# EAGLE design Hatch2020Trophy0805_1 (EAGLE 9.5.0)

## Sheet 1 of 2
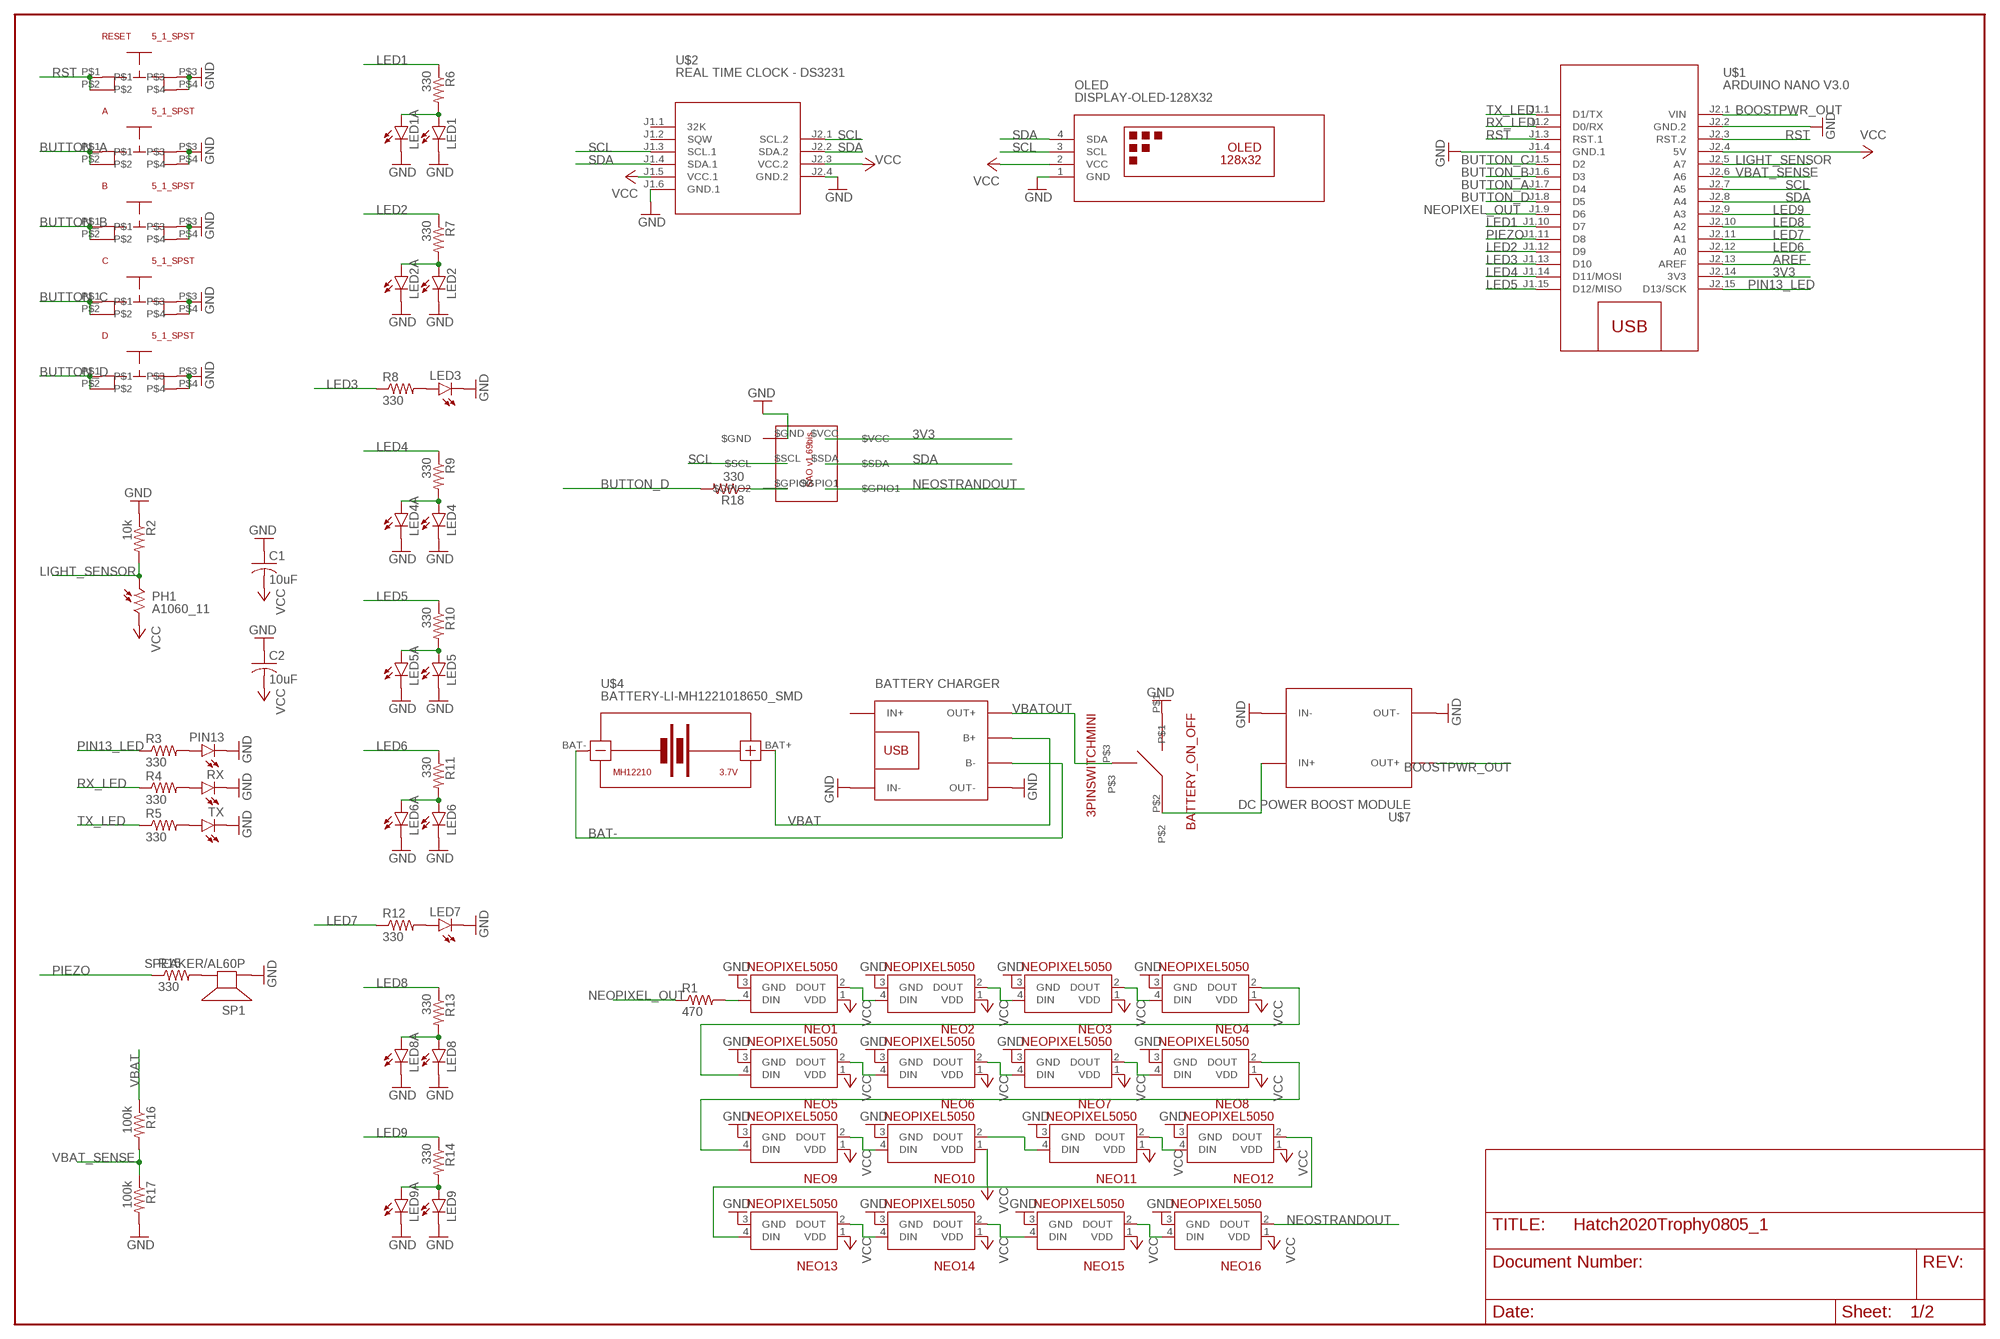
[diagram p0: schematic, sheet 1]

### Parts
A  5_1_SPST  [5_1_SPST]
B  5_1_SPST  [5_1_SPST]
BATTERY_ON_OFF  3PINSWITCHMINI  [3PINMINI]
C  5_1_SPST  [5_1_SPST]
C1  10uF  C-USC0805  [C0805]
C2  10uF  C-USC0805  [C0805]
D  5_1_SPST  [5_1_SPST]
LED1  LEDSML0805  [SML0805]
LED1A  LEDSML0805  [SML0805]
LED2  LEDSML0805  [SML0805]
LED2A  LEDSML0805  [SML0805]
LED3  LEDSML0805  [SML0805]
LED4  LEDSML0805  [SML0805]
LED4A  LEDSML0805  [SML0805]
LED5  LEDSML0805  [SML0805]
LED5A  LEDSML0805  [SML0805]
LED6  LEDSML0805  [SML0805]
LED6A  LEDSML0805  [SML0805]
LED7  LEDSML0805  [SML0805]
LED8  LEDSML0805  [SML0805]
LED8A  LEDSML0805  [SML0805]
LED9  LEDSML0805  [SML0805]
LED9A  LEDSML0805  [SML0805]
NEO1  NEOPIXEL5050  [NEOPIXEL5050]
NEO2  NEOPIXEL5050  [NEOPIXEL5050]
NEO3  NEOPIXEL5050  [NEOPIXEL5050]
NEO4  NEOPIXEL5050  [NEOPIXEL5050]
NEO5  NEOPIXEL5050  [NEOPIXEL5050]
NEO6  NEOPIXEL5050  [NEOPIXEL5050]
NEO7  NEOPIXEL5050  [NEOPIXEL5050]
NEO8  NEOPIXEL5050  [NEOPIXEL5050]
NEO9  NEOPIXEL5050  [NEOPIXEL5050]
NEO10  NEOPIXEL5050  [NEOPIXEL5050]
NEO11  NEOPIXEL5050  [NEOPIXEL5050]
NEO12  NEOPIXEL5050  [NEOPIXEL5050]
NEO13  NEOPIXEL5050  [NEOPIXEL5050]
NEO14  NEOPIXEL5050  [NEOPIXEL5050]
NEO15  NEOPIXEL5050  [NEOPIXEL5050]
NEO16  NEOPIXEL5050  [NEOPIXEL5050]
OLED  DISPLAY-OLED-128X32  [DISPLAY-OLED-128X32]
PH1  A1060_11  [T0-46-A10XX]
PIN13  LEDSML0805  [SML0805]
R1  470  R-US_R0805  [R0805]
R2  10k  R-US_R0805  [R0805]
R3  330  R-US_R0805  [R0805]
R4  330  R-US_R0805  [R0805]
R5  330  R-US_R0805  [R0805]
R6  330  R-US_R0805  [R0805]
R7  330  R-US_R0805  [R0805]
R8  330  R-US_R0805  [R0805]
R9  330  R-US_R0805  [R0805]
R10  330  R-US_R0805  [R0805]
R11  330  R-US_R0805  [R0805]
R12  330  R-US_R0805  [R0805]
R13  330  R-US_R0805  [R0805]
R14  330  R-US_R0805  [R0805]
R15  330  R-US_R0805  [R0805]
R16  100k  R-US_R0805  [R0805]
R17  100k  R-US_R0805  [R0805]
R18  330  R-US_R1206  [R1206]
RESET  5_1_SPST  [5_1_SPST]
RX  LEDSML0805  [SML0805]
SP1  SPEAKER/AL60P  [AL60P]
TX  LEDSML0805  [SML0805]
U$1  ARDUINO NANO V3.0  ARDUINO-NANO-3.0  [ARDUINO-NANO-3.0]
U$2  REAL TIME CLOCK - DS3231  RTC-DS3231-AT24C32  [RTC-DS3231-AT24C32]
U$3  SAO-1.69  [2X3-SHROUDED-FEMALE]
U$4  BATTERY-LI-MH1221018650_SMD  [BATTERY_18650_SMD]
U$6  BATTERY CHARGER  BATTERY-CHARGER-LI-PROTLOW_FP  [BAT_CHARGE_LOW_FP]
U$7  DC POWER BOOST MODULE  DC-DC-STEP-UP-MT3608LOW_FP  [DC-DC-STEP-UP-LOW_FP]

### Nets
3V3 [PWR]: U$1.J2.14(3V3) U$3.$VCC
AREF [PWR]: U$1.J2.13(AREF)
BAT- [PWR]: U$4.BAT- U$6.B-
BOOSTPWR_OUT [PWR]: U$1.J2.1(VIN) U$7.OUT+
BUTTON_A: A.P$1 A.P$2 U$1.J1.7(D4)
BUTTON_B: B.P$1 B.P$2 U$1.J1.6(D3)
BUTTON_C: C.P$1 C.P$2 U$1.J1.5(D2)
BUTTON_D: D.P$1 D.P$2 R18.2 U$1.J1.8(D5)
GND [GND]: A.P$3 A.P$4 B.P$3 B.P$4 BATTERY_ON_OFF.P$1 C1.1 C2.1 C.P$3 C.P$4 D.P$3 D.P$4 LED1.C LED1A.C LED2.C LED2A.C LED3.C LED4.C LED4A.C LED5.C LED5A.C LED6.C LED6A.C LED7.C LED8.C LED8A.C LED9.C LED9A.C NEO1.3(GND) NEO2.3(GND) NEO3.3(GND) NEO4.3(GND) NEO5.3(GND) NEO6.3(GND) NEO7.3(GND) NEO8.3(GND) NEO9.3(GND) NEO10.3(GND) NEO11.3(GND) NEO12.3(GND) NEO13.3(GND) NEO14.3(GND) NEO15.3(GND) NEO16.3(GND) OLED.1(GND) PIN13.C R2.1 R17.2 RESET.P$3 RESET.P$4 RX.C SP1.1(+) TX.C U$1.J1.4(GND.1) U$1.J2.2(GND.2) U$2.J1.6(GND.1) U$2.J2.4(GND.2) U$3.$GND U$6.IN- U$6.OUT- U$7.IN- U$7.OUT-
LED1: R6.1 U$1.J1.10(D7)
LED1W: LED1.A LED1A.A R6.2
LED2: R7.1 U$1.J1.12(D9)
LED2W: LED2.A LED2A.A R7.2
LED3: R8.1 U$1.J1.13(D10)
LED3W: LED3.A R8.2
LED4: R9.1 U$1.J1.14(D11/MOSI)
LED4W: LED4.A LED4A.A R9.2
LED5: R10.1 U$1.J1.15(D12/MISO)
LED5W: LED5.A LED5A.A R10.2
LED6: R11.1 U$1.J2.12(A0)
LED6W: LED6.A LED6A.A R11.2
LED7: R12.1 U$1.J2.11(A1)
LED7W: LED7.A R12.2
LED8: R13.1 U$1.J2.10(A2)
LED8W: LED8.A LED8A.A R13.2
LED9: R14.1 U$1.J2.9(A3)
LED9W: LED9.A LED9A.A R14.2
LIGHT_SENSOR: PH1.1 R2.2 U$1.J2.5(A7)
N$1: NEO13.2(DOUT) NEO14.4(DIN)
N$2: NEO11.2(DOUT) NEO12.4(DIN)
N$3: NEO12.2(DOUT) NEO13.4(DIN)
N$4: NEO14.2(DOUT) NEO15.4(DIN)
N$5: NEO15.2(DOUT) NEO16.4(DIN)
N$6: R15.2 SP1.2(-)
N$7: R18.1 U$3.$GPIO2
N$8: NEO4.2(DOUT) NEO5.4(DIN)
N$12: NEO1.4(DIN) R1.2
N$13: NEO8.2(DOUT) NEO9.4(DIN)
N$14: PIN13.A R3.2
N$15: R4.2 RX.A
N$16: R5.2 TX.A
N$18: NEO1.2(DOUT) NEO2.4(DIN)
N$20: NEO2.2(DOUT) NEO3.4(DIN)
N$21: NEO3.2(DOUT) NEO4.4(DIN)
N$23: NEO5.2(DOUT) NEO6.4(DIN)
N$24: NEO6.2(DOUT) NEO7.4(DIN)
N$25: NEO7.2(DOUT) NEO8.4(DIN)
N$27: NEO9.2(DOUT) NEO10.4(DIN)
N$28: NEO10.2(DOUT) NEO11.4(DIN)
NEOPIXEL_OUT: R1.1 U$1.J1.9(D6)
NEOSTRANDOUT: NEO16.2(DOUT) U$3.$GPIO1
PIEZO: R15.1 U$1.J1.11(D8)
PIN13_LED: R3.1 U$1.J2.15(D13/SCK)
RST: RESET.P$1 RESET.P$2 U$1.J1.3(RST.1) U$1.J2.3(RST.2)
RX_LED: R4.1 U$1.J1.2(D0/RX)
SCL: OLED.3(SCL) U$1.J2.7(A5) U$2.J1.3(SCL.1) U$2.J2.1(SCL.2) U$3.$SCL
SDA: OLED.4(SDA) U$1.J2.8(A4) U$2.J1.4(SDA.1) U$2.J2.2(SDA.2) U$3.$SDA
TX_LED: R5.1 U$1.J1.1(D1/TX)
VBAT [PWR]: R16.1 U$4.BAT+ U$6.B+
VBAT_SENSE: R16.2 R17.1 U$1.J2.6(A6)
VBATOUT [PWR]: BATTERY_ON_OFF.P$3 U$6.OUT+
VBOOST_IN [PWR]: BATTERY_ON_OFF.P$2 U$7.IN+
VCC [PWR]: C1.2 C2.2 NEO1.1(VDD) NEO2.1(VDD) NEO3.1(VDD) NEO4.1(VDD) NEO5.1(VDD) NEO6.1(VDD) NEO7.1(VDD) NEO8.1(VDD) NEO9.1(VDD) NEO10.1(VDD) NEO11.1(VDD) NEO12.1(VDD) NEO13.1(VDD) NEO14.1(VDD) NEO15.1(VDD) NEO16.1(VDD) OLED.2(VCC) PH1.2 U$1.J2.4(5V) U$2.J1.5(VCC.1) U$2.J2.3(VCC.2)
Unconnected: U$2.J1.1(32K) U$2.J1.2(SQW) U$6.IN+

## Sheet 2 of 2

## Library data of the parts
A B C D RESET = TrophyParts:5_1_SPST
BATTERY_ON_OFF = TrophyParts:3PINSWITCHMINI
C1 C2 = rcl:C-US: CAPACITOR, American symbol; SPICEPREFIX: C
LED1 LED1A LED2 LED2A LED3 LED4 LED4A LED5 LED5A LED6 LED6A LED7 LED8 LED8A LED9 LED9A PIN13 RX TX = led:LED: LED OSRAM: - CHIPLED LG R971, LG N971, LY N971, LG Q971, LY Q971, LO R971, LY R971 LH N974, LH R974 LS Q976, LO Q976, LY Q976 LO Q996 - Hyper CHIPLED LW Q18S LB Q993, LB Q99A, LB R99A - SideLED LS A670, LO A670, LY A670, LG A670, LP A670 LB A673, LV A673, LT A673, LW A673 LH A674 LY A675 LS A676, LA A676, LO A676, LY A676, LW A676 LS A679, LY A679, LG A679 - Hyper Micro SIDELED® LS Y876, LA Y876, LO Y876, LY Y876 LT Y87S - SmartLED LW L88C, LW L88S LB L89C, LB L89S, LG L890 LS L89K, LO L89K, LY L89K LS L896, LA L896, LO L896, LY L896 - TOPLED LS T670, LO T670, LY T670, LG T670, LP T670 LSG T670, LSP T670, LSY T670, LOP T670, LYG T670 LG T671, LOG T671, LSG T671 LB T673, LV T673, LT T673, LW T673 LH T674 LS T676, LA T676, LO T676, LY T676, LB T676, LH T676, LSB T676, LW T676 LB T67C, LV T67C, LT T67C, LS T67K, LO T67K, LY T67K, LW E67C LS E67B, LA E67B, LO E67B, LY E67B, LB E67C, LV E67C, LT E67C LW T67C LS T679, LY T679, LG T679 LS T770, LO T770, LY T770, LG T770, LP T770 LB T773, LV T773, LT T773, LW T773 LH T774 LS E675, LA E675, LY E675, LS T675 LS T776, LA T776, LO T776, LY T776, LB T776 LHGB T686 LT T68C, LB T68C - Hyper Mini TOPLED® LB M676 - Mini TOPLED Santana® LG M470 LS M47K, LO M47K, LY M47K Source: http://www.osram.convergy.de LUXEON: - LUMILED® LXK2-PW12-R00, LXK2-PW12-S00, LXK2-PW14-U00, LXK2-PW14-V00 LXK2-PM12-R00, LXK2-PM12-S00, LXK2-PM14-U00 LXK2-PE12-Q00, LXK2-PE12-R00, LXK2-PE12-S00, LXK2-PE14-T00, LXK2-PE14-U00 LXK2-PB12-K00, LXK2-PB12-L00, LXK2-PB12-M00, LXK2-PB14-N00, LXK2-PB14-P00, LXK2-PB14-Q00 LXK2-PR12-L00, LXK2-PR12-M00, LXK2-PR14-Q00, LXK2-PR14-R00 LXK2-PD12-Q00, LXK2-PD12-R00, LXK2-PD12-S00 LXK2-PH12-R00, LXK2-PH12-S00 LXK2-PL12-P00, LXK2-PL12-Q00, LXK2-PL12-R00 Source: www.luxeon.com KINGBRIGHT: KA-3528ASYC Source: www.kingbright.com
NEO1-NEO16 = TrophyParts:NEOPIXEL5050
OLED = Hatch2020:DISPLAY-OLED-128X32: 128x32 Dot Matrix OLED Module with I2C interface based on SSD1306 chip More details available here: http://www.tinyosshop.com/index.php?route=product/product&product_id=953 Schematic available here: http://www.tinyosshop.com/datasheet/OLED%2012832.pdf SSD1306 datasheet: https://cdn-shop.adafruit.com/datasheets/SSD1306.pdf Click here to find device on ebay.com
PH1 = photo-elements:A10: Sensor Robust Light Sensing Applications Outdoor Light Sensing Application Source: http://optoelectronics.perkinelmer.com/content/Datasheets/DTS_PhotocellsA1050.pdf
R1-R18 = rcl:R-US_: RESISTOR, American symbol; SPICEPREFIX: R
SP1 = adafruit:SPEAKER: SPEAKER Source: Buerklin Added PS12 (for part # PS1240 piezo) http://www.ladyada.net/library/pcb/eaglelibrary.html
U$1 = diy-modules:ARDUINO-NANO-3.0: Arduino Nano 3.0 and compatible devices More details available here: https://www.arduino.cc/en/Main/ArduinoBoardNano Click here to find device on ebay.com
U$2 = Hatch2020:RTC-DS3231-AT24C32: RTC Module with Battery and EEPROM based on DS3231 and AT24C32 chips Tutorial can be found here: https://edwardmallon.wordpress.com/2014/05/21/using-a-cheap-3-ds3231-rtc-at24c32-eeprom-from-ebay/ Click here to find device on ebay.com
U$3 = Hatch2020:SAO-1.69
U$4 = Hatch2020:BATTERY-LI-MH12210: Lithium-Ion MH12210 Rechargeable Battery Panasonic NCR18650PF battery datasheet available here: https://industrial.panasonic.com/cdbs/www-data/pdf2/ACI4000/ACI4000C12.pdf Click here to find device on ebay.com
U$6 = Hatch2020:BATTERY-CHARGER-LI-PROT: Lithium Battery 5V Charger with protection circuit More details available here: http://www.instructables.com/id/DIY-Lithium-ion-Battery-Charger/step4/TP4056-based-lithium-ion-battery-charger-module/ Click here to find device on ebay.com
U$7 = Hatch2020:DC-DC-STEP-UP-MT3608: DC/DC Step-Up Regulator based on MT3608 chip MT3608 datasheet available here: https://www.olimex.com/Products/Breadboarding/BB-PWR-3608/resources/MT3608.pdf Click here to find device on ebay.com

## Net classes
1 PWR: width 0.508 mm
2 5V: width 0.508 mm
3 GND: width 0.254 mm

## Board
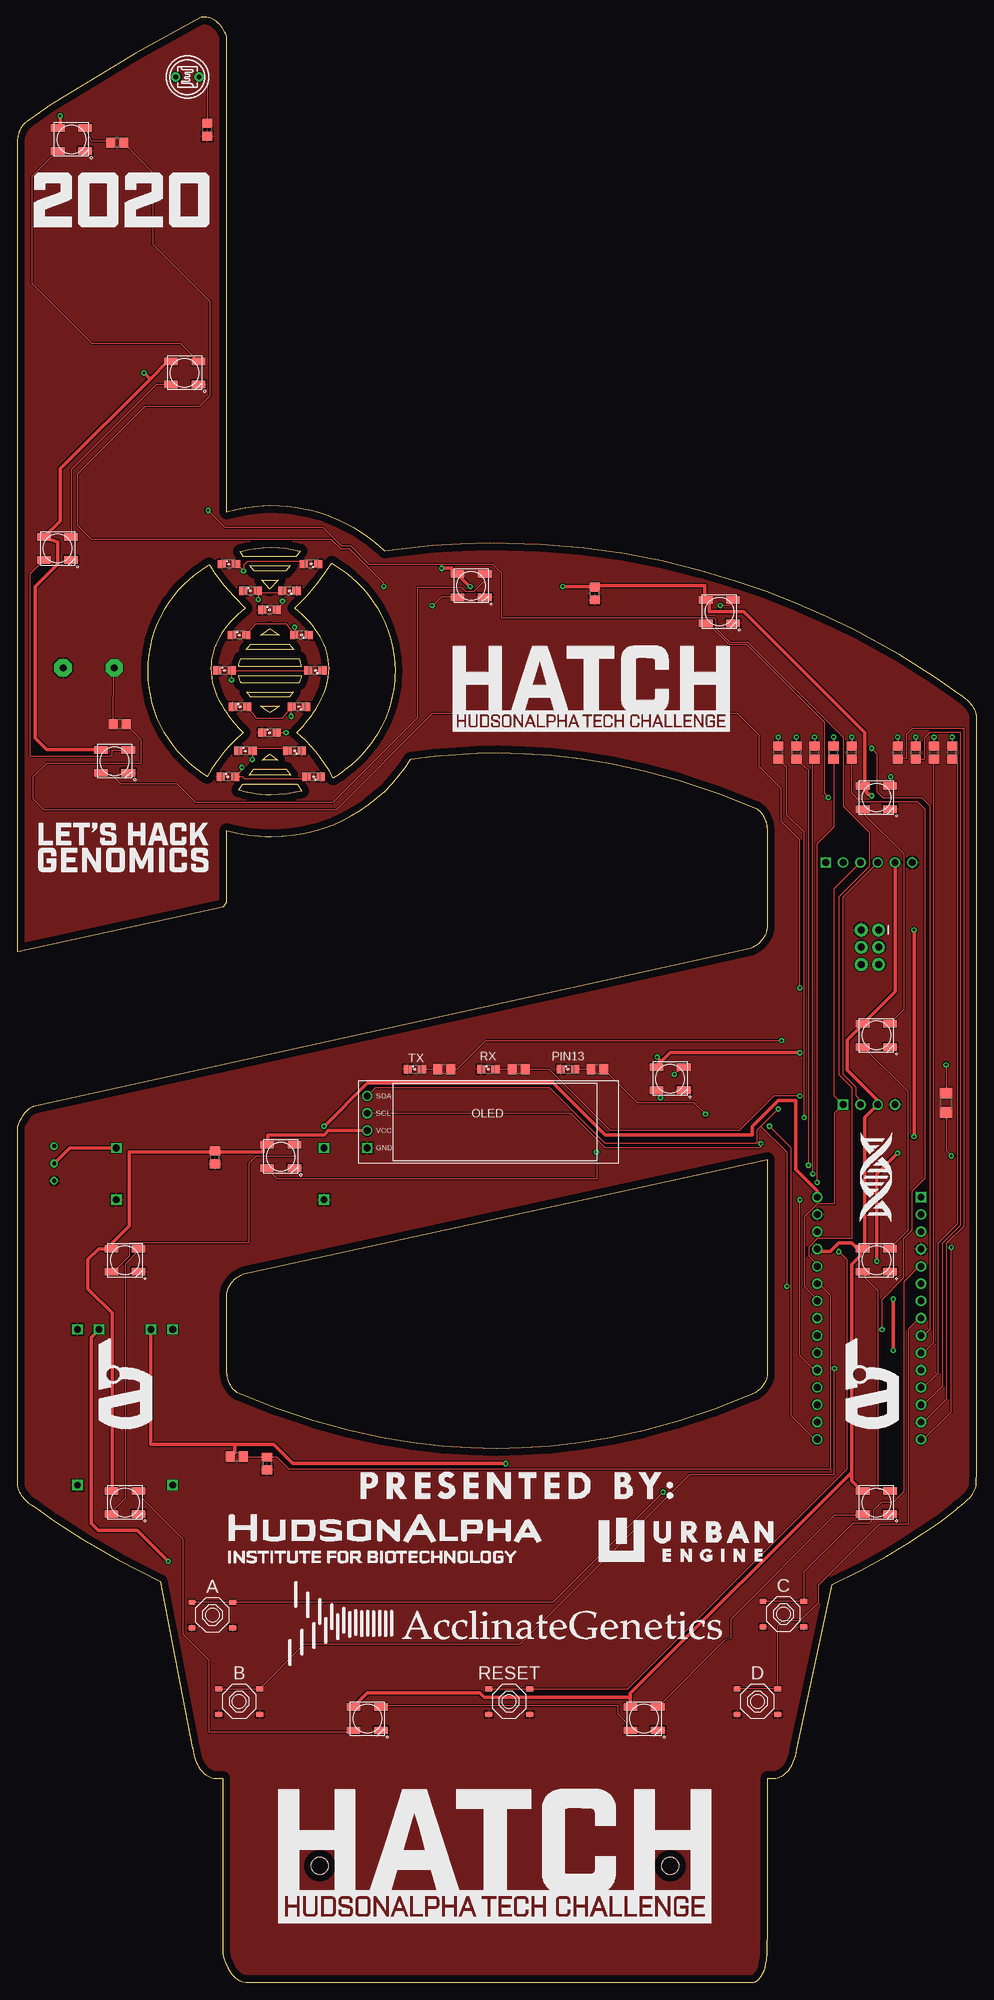
[diagram p1: board, top side]
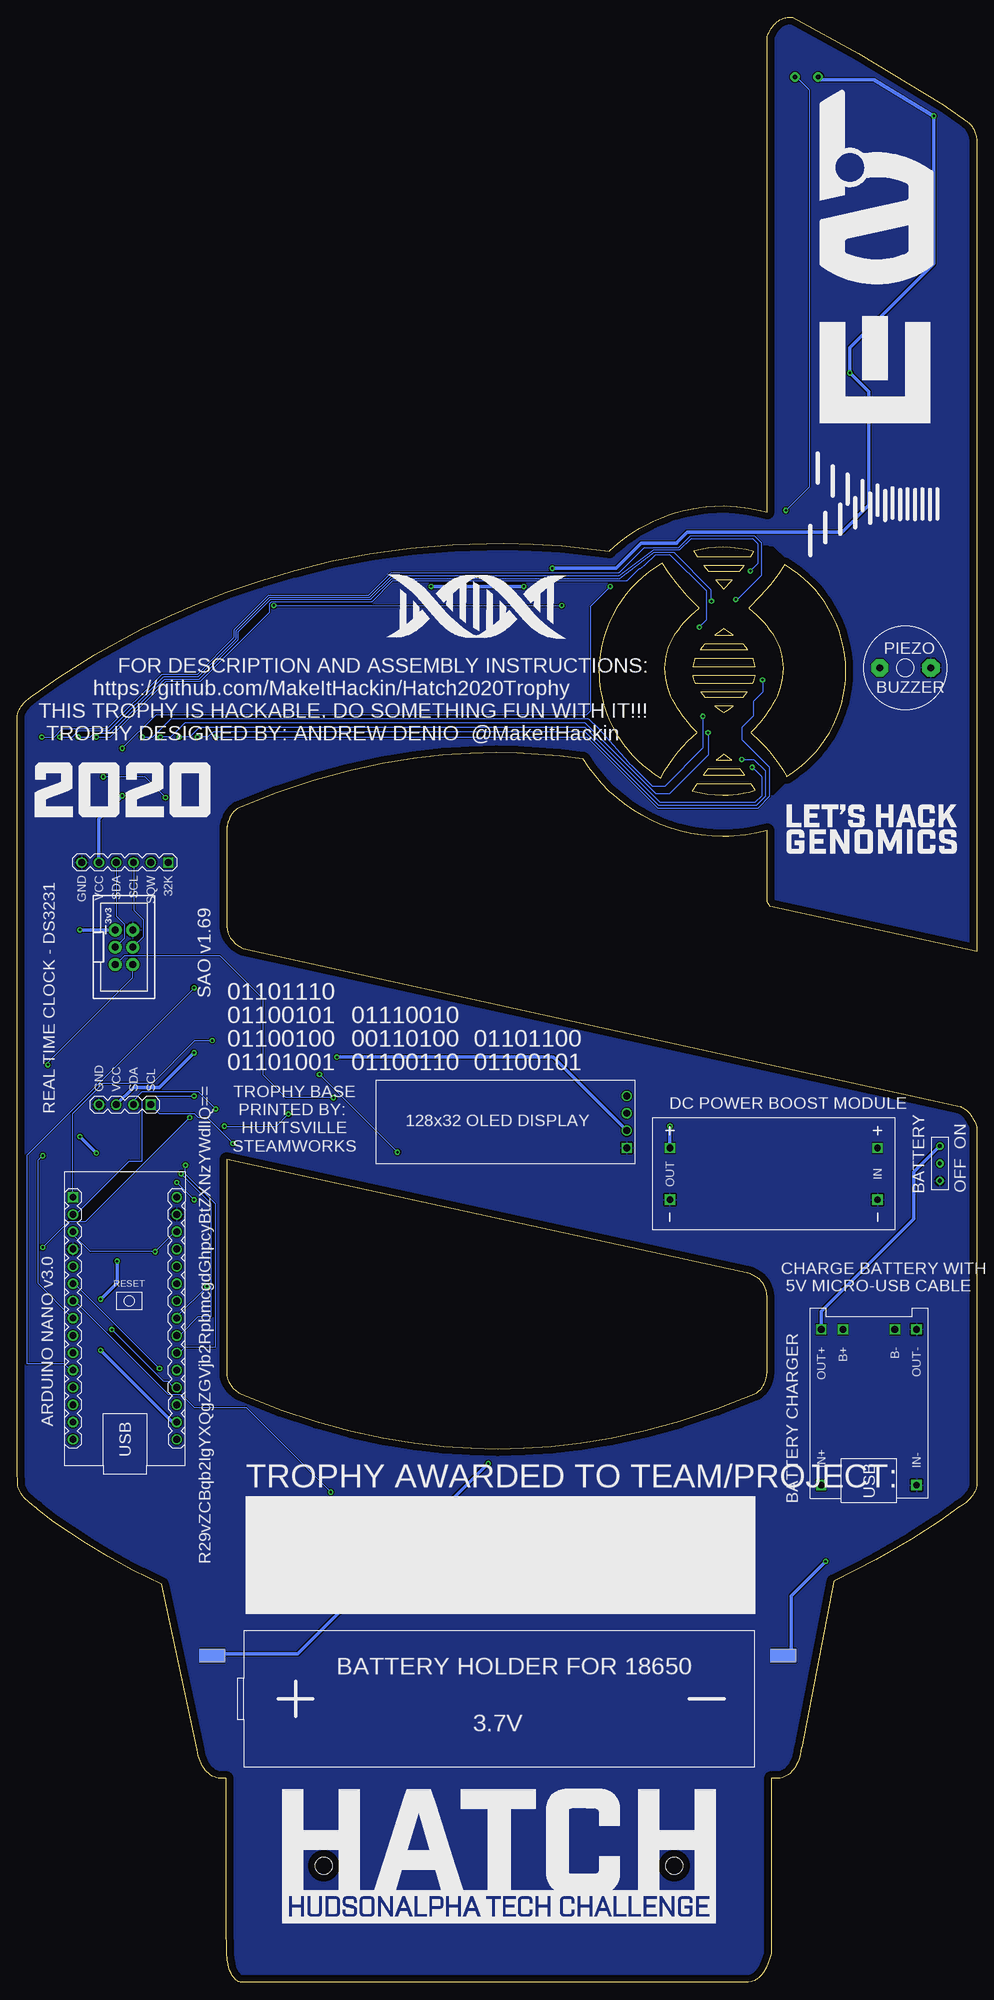
[diagram p2: board, bottom side, seen from below]

Size 140.9 x 288.58 mm. Coordinates in mm from the lower left corner, seen from the top.
Outline: 649 segments
Copper layers (1*16): Top 0.035mm / dielectric 1.5mm / Bottom 0.035mm
Design rules "default *": minimum track width 6mil, minimum drill 0.35mm, track to track 6mil, track to pad 6mil, pad to pad 6mil, via to via 6mil, smd to smd 6mil, copper to edge 40mil, drill to drill 6mil, minimum pad ring 10mil, minimum via ring 8mil, stop-mask expansion 4mil, vias tented up to drill 15mil, thermal gap 10mil
Holes 2.54 mm at 44.43,17.13 95.86,17.13
bRestrict: area 25.9,174.4 to 48.5,210.9

### Footprints (pad centres in the part's own frame; a part is rotated, then mirrored left to right if it is on the bottom)
5_1_SPST = smd 1 x 0.75: P$1 -3,1.875; P$2 3,1.875; P$3 -3,-1.875; P$4 3,-1.875
3PINMINI = drill 0.6: P$1 1.27,3.81; P$2 3.81,3.81; P$3 6.35,3.81
C0805 = smd 1.3 x 1.5: 1 -0.95,0; 2 0.95,0
SML0805 = smd 1.2 x 1.2: A 1.05,0; C -1.05,0
NEOPIXEL5050 = smd 2 x 1.1: 1 -2,1.7; 2 -2,-1.7; 3 2,-1.7; 4 2,1.7
DISPLAY-OLED-128X32 = drill 1 square: 1 -17.78,-3.81 | drill 1: 2 -17.78,-1.27; 3 -17.78,1.27; 4 -17.78,3.81
T0-46-A10XX = drill 0.7 pad 1.4: 1 -1.7,0; 2 1.7,0
R0805 = smd 1.3 x 1.5: 1 -0.95,0; 2 0.95,0
R1206 = smd 1.6 x 1.803: 1 -1.422,0; 2 1.422,0
AL60P = drill 1.016 pad 2.54 octagon: 1 -3.759,0; 2 3.759,0
ARDUINO-NANO-3.0 = drill 1 square: J1.1 17.78,7.62 | drill 1: J1.2 15.24,7.62; J1.3 12.7,7.62; J1.4 10.16,7.62; J1.5 7.62,7.62; J1.6 5.08,7.62; J1.7 2.54,7.62; J1.8 0,7.62; J1.9 -2.54,7.62; J1.10 -5.08,7.62; J1.11 -7.62,7.62; J1.12 -10.16,7.62; J1.13 -12.7,7.62; J1.14 -15.24,7.62; J1.15 -17.78,7.62; J2.1 17.78,-7.62; J2.2 15.24,-7.62; J2.3 12.7,-7.62; J2.4 10.16,-7.62; J2.5 7.62,-7.62; J2.6 5.08,-7.62; J2.7 2.54,-7.62; J2.8 0,-7.62; J2.9 -2.54,-7.62; J2.10 -5.08,-7.62; J2.11 -7.62,-7.62; J2.12 -10.16,-7.62; J2.13 -12.7,-7.62; J2.14 -15.24,-7.62; J2.15 -17.78,-7.62
RTC-DS3231-AT24C32 = drill 1 square: J1.1 -17.78,6.35; J2.1 17.78,3.81 | drill 1: J1.2 -17.78,3.81; J1.3 -17.78,1.27; J1.4 -17.78,-1.27; J1.5 -17.78,-3.81; J1.6 -17.78,-6.35; J2.2 17.78,1.27; J2.3 17.78,-1.27; J2.4 17.78,-3.81
2X3-SHROUDED-FEMALE = drill 1.016 pad 1.88: $GND 1.27,2.54; $GPIO1 3.81,-2.54; $GPIO2 1.27,-2.54; $SCL 1.27,0; $SDA 3.81,0; $VCC 3.81,2.54
BATTERY_18650_SMD = smd 3.81 x 1.93: BAT+ -40.64,6.35; BAT- 43.18,6.35
BAT_CHARGE_LOW_FP = drill 1 square: B+ 11.43,3.81; B- 11.43,-3.81; IN+ -11.43,6.985; IN- -11.43,-6.985; OUT+ 11.43,6.985; OUT- 11.43,-6.985
DC-DC-STEP-UP-LOW_FP = drill 1 square: IN+ 15.24,3.81; IN- 15.24,-3.81; OUT+ -15.24,3.81; OUT- -15.24,-3.81

### Placement (x,y rotation side)
A  28.68,53.96 0 top
B  32.62,41.26 0 top
BATTERY_ON_OFF  1.63,116.45 90 bottom
C  112.5,54.09 0 top
C1  29.06,121.15 90 top
C2  84.81,203.95 90 top
D  108.69,41.26 0 top
LED1  31.09,208.27 0 top
LED1A  43.16,208.27 180 top
LED2  34.27,204.33 0 top
LED2A  39.98,204.33 180 top
LED3  37.06,201.54 0 top
LED4  32.62,197.85 0 top
LED4A  41.76,197.85 180 top
LED5  30.46,192.65 0 top
LED5A  43.79,192.65 180 top
LED6  32.74,187.31 0 top
LED6A  41.38,187.31 180 top
LED7  37.06,183.5 0 top
LED8  33.5,180.84 0 top
LED8A  40.74,180.84 180 top
LED9  30.96,177.03 0 top
LED9A  43.54,177.03 180 top
NEO1  7.98,270.63 0 top
NEO2  24.61,236.34 0 top
NEO3  5.95,210.55 0 top
NEO4  14.33,179.31 0 top
NEO5  66.65,205.09 0 top
NEO6  103.1,201.28 0 top
NEO7  126.15,173.98 0 top
NEO8  126.15,139.05 0 top
NEO9  126.15,106.03 0 top
NEO10  126.15,70.47 0 top
NEO11  92.05,38.72 0 top
NEO12  51.41,38.72 0 top
NEO13  15.85,70.47 0 top
NEO14  15.85,106.03 0 top
NEO15  38.71,121.27 0 top
NEO16  95.86,132.7 0 top
OLED  69.19,126.35 0 top
PH1  25,279.77 180 top
PIN13  80.88,134.1 0 top
R1  14.71,270.12 180 top
R2  27.92,272.02 90 top
R3  85.19,134.1 180 top
R4  73.64,134.1 180 top
R5  62.71,134.1 180 top
R6  134.6,180.58 90 top
R7  137.26,180.58 90 top
R8  131.93,180.58 90 top
R9  129.26,180.58 90 top
R10  111.74,180.58 90 top
R11  122.53,180.58 90 top
R12  119.86,180.58 90 top
R13  114.4,180.58 90 top
R14  117.07,180.58 90 top
R15  15.09,184.77 180 top
R16  32.23,77.2 0 top
R17  36.68,76.19 270 top
R18  136.37,129.15 270 top
RESET  72.24,41.26 0 top
RX  69.19,134.1 0 top
SP1  10.52,193.03 180 bottom
TX  58.4,134.1 0 top
U$1  125.07,97.52 90 bottom
U$2  125.07,146.67 270 bottom
U$3  122.66,152.01 0 top
U$4  71.6,41.64 0 bottom
U$6  15.85,84.44 90 bottom
U$7  29.82,118.73 0 bottom

### Tracks (layer width: path | path; a pad name or v marks a point on that pad's centre or on a via)
3V3  (via drill 0.35)
  Top 0.508: v128.63,92.83 v128.63,100.32 | v126.21,105.91 126.21,118.73 v129.26,121.78 | v131.68,124.19 v131.68,154.55
  Bottom 0.508: U$1.J2.14 118.09,82.28 v128.63,92.83 | v128.63,100.32 126.21,102.73 v126.21,105.91 | v129.26,121.78 v131.68,124.19 | v131.68,154.55 U$3.$VCC
BAT-  (via drill 0.35)
  Top 0.508: U$6.B- 10.9,94.73 10.9,67.43 11.91,66.41 17.63,66.41 v22.2,61.84
  Bottom 0.508: v22.2,61.84 27.28,56.76 27.28,48.25 27.92,48.25 U$4.BAT-
BOOSTPWR_OUT  (via drill 0.35)
  Top 0.508: v45.06,125.72 51.41,132.07 78.72,132.07 86.34,124.45 107.93,124.45 107.93,125.72 111.74,129.53 114.28,129.53 114.28,119.37 117.45,116.19 U$1.J2.1
  Bottom 0.508: v45.06,125.72 U$7.OUT+
BUTTON_A  (via drill 0.35)
  Top 0.152: v94.85,72 78.72,55.87 25.71,55.87 A.P$1 A.P$2
  Bottom 0.152: v94.85,72 107.29,84.44 114.91,84.44 116.82,86.35 118.72,86.35 132.06,99.68 132.69,99.68 U$1.J1.7
BUTTON_B  (via drill 0.35)
  Top 0.152: v119.99,90.16 119.86,90.03 119.86,74.54 98.66,74.54 73.86,49.74 41.96,49.74 41.96,49.48 B.P$2 B.P$1
  Bottom 0.152: v119.99,90.16 132.06,102.22 132.69,102.22 U$1.J1.6
BUTTON_C
  Top 0.152: U$1.J1.5 132.69,105.4 130.15,102.86 130.15,72 128.63,70.47 126.85,70.47 125.71,69.33 125.71,68.06 125.07,67.43 122.66,67.43 115.52,60.28 115.52,55.98 | 115.52,55.98 115.52,55.97 C.P$2 | C.P$2 115.52,55.98 | C.P$2 C.P$1
BUTTON_D  (via drill 0.35)
  Top 0.152: U$1.J1.8 132.69,97.78 130.79,95.87 130.79,67.3 126.6,67.3 117.58,58.28 117.58,55.74 114.91,53.07 112.37,53.07 111.61,52.31 111.61,43.22 D.P$2 D.P$1 | R18.2 136.37,122.16 v137.14,121.4
  Bottom 0.152: U$1.J1.8 137.77,102.6 137.77,120.77 v137.14,121.4
GND
  pour Top: -3.45,291.2 146.03,291.2 146.03,-1.54 -3.45,-1.54
  pour Bottom: -4.47,292.22 147.8,292.22 147.8,-2.81 -4.47,-2.81
LED1
  Top 0.152: R6.1 134.6,93.97 132.69,92.06 U$1.J1.10
LED1W  (via drill 0.35)
  Top 0.152: LED1.A 32.23,208.27 v33.25,207.25 33.25,208.14 33.76,208.65 42.03,208.65 LED1A.A | v134.6,182.87 R6.2
  Bottom 0.152: v33.25,207.25 32.11,208.4 32.11,211.19 32.87,211.95 42.01,211.95 43.66,210.3 47.52,210.3 52.49,206.57 85.93,206.57 89.11,203.39 103.81,203.39 108.71,198.49 108.71,197.32 114.28,191.76 119.36,191.76 127.33,183.78 131.88,183.78 132.79,182.87 v134.6,182.87
LED2
  Top 0.152: R7.1 138.03,178.97 138.03,111.37 135.23,108.57 135.23,89.52 132.69,86.98 U$1.J1.12
LED2W  (via drill 0.35)
  Top 0.152: LED2A.A 38.8,204.08 35.45,204.08 LED2.A 35.41,204.24 v35.41,203.06 | v137.26,182.87 R7.2
  Bottom 0.152: v35.41,203.06 35.16,203.06 31.6,206.62 31.6,211.32 32.62,212.33 42.08,212.33 43.81,210.61 48.89,210.61 52.49,207 85.96,207 89.26,203.69 103.93,203.69 109.02,198.61 109.02,197.53 114.4,192.14 119.61,192.14 127.67,184.08 134.24,184.08 135.45,182.87 v137.26,182.87
LED3
  Top 0.152: R8.1 132,179.57 133.2,179.57 133.2,182.74 133.96,183.5 138.53,183.5 138.53,111.24 135.87,108.57 135.87,87.62 132.69,84.44 U$1.J1.13
LED3W  (via drill 0.35)
  Top 0.152: v38.97,202.81 38.97,202.39 LED3.A | v131.93,182.87 R8.2
  Bottom 0.152: v38.97,202.81 38.97,204.46 44.43,209.92 47.41,209.92 52.45,206.13 85.93,206.13 88.99,203.08 103.68,203.08 108.41,198.36 108.41,197.14 114.15,191.4 119.21,191.4 127.13,183.48 129.51,183.48 130.12,182.87 v131.93,182.87
LED4
  Top 0.152: R9.1 129.31,179.69 130.53,179.69 130.53,183.25 131.42,184.14 139.04,184.14 139.04,111.11 136.5,108.57 136.5,85.71 132.69,81.9 U$1.J1.14
LED4W  (via drill 0.35)
  Top 0.152: LED4.A 35.02,199.51 39.49,199.51 40.71,198.01 LED4A.A 40.74,197.89 v40.74,199 | v129.26,182.87 R9.2
  Bottom 0.152: v40.74,199 39.73,200.01 39.73,204.33 45,209.6 47.22,209.6 48.73,208.09 48.84,208 49.2,207.75 49.21,207.71 49.46,207.51 49.64,207.51 51.42,205.73 85.83,205.73 88.78,202.78 103.48,202.78 103.83,202.42 103.83,201.22 113.95,191.1 118.97,191.1 127.2,182.87 v129.26,182.87
LED5  (via drill 0.35)
  Top 0.152: R10.1 112.95,178.42 113.01,178.42 113.01,171.44 115.55,168.9 v115.55,126.99 | v137.14,107.94 137.14,83.81 132.69,79.36 U$1.J1.15
  Bottom 0.152: v115.55,126.99 130.79,111.75 133.33,111.75 v137.14,107.94
LED5W  (via drill 0.35)
  Top 0.152: LED5A.A LED5.A 31.47,192.38 v31.47,191.25 | v111.74,182.87 R10.2
  Bottom 0.152: v31.47,191.25 31.47,189.47 32.87,188.08 32.87,185.92 34.52,184.27 34.52,182.49 30.46,178.42 30.46,174.11 32.11,172.45 46.84,172.45 57.25,182.87 v111.74,182.87
LED6  (via drill 0.35)
  Top 0.152: R11.1 122.53,174.61 123.8,173.34 132.18,173.34 133.33,172.2 133.33,118.1 131.42,116.19 131.42,110.48 130.15,109.21 130.15,103.49 126.98,100.32 v126.98,95.87
  Bottom 0.152: v126.98,95.87 119.36,88.25 118.72,88.25 118.09,87.62 117.45,87.62 U$1.J2.12
LED6W  (via drill 0.35)
  Top 0.152: LED6.A 35.14,185.66 38.98,185.66 LED6A.A 40.2,187.19 40.2,185.95 v40.24,185.92 | v122.53,182.87 R11.2
  Bottom 0.152: v40.24,185.92 40.24,181.22 45.82,175.63 47.62,175.63 50.29,178.3 50.3,178.3 50.61,178.61 50.94,178.91 50.94,178.94 51.08,179.08 51.11,179.08 55.52,184.11 56.95,185.54 118.34,185.54 121.01,182.87 v122.53,182.87
LED7  (via drill 0.35)
  Top 0.152: R12.1 119.86,169.66 117.45,167.25 v117.45,117.46 | v114.91,114.92 114.91,92.06 117.45,89.52 U$1.J2.11
  Bottom 0.152: v114.91,114.92 v117.45,117.46
LED7W  (via drill 0.35)
  Top 0.152: LED7.A v39.47,183.5 | v119.86,182.87 R12.2
  Bottom 0.152: v39.47,183.5 39.47,180.2 45.19,174.49 47.09,174.49 57.51,184.9 116.31,184.9 118.34,182.87 v119.86,182.87
LED8  (via drill 0.35)
  Top 0.152: v116.18,120 116.18,178.04 115.69,178.35 R13.1
  Bottom 0.152: v116.18,120 116.18,118.73 111.74,114.29 111.74,93.33 116.18,93.33 116.82,92.7 117.45,92.7 U$1.J2.10
LED8W  (via drill 0.35)
  Top 0.152: LED8A.A 39.44,181.22 34.77,181.22 34.39,180.84 LED8.A 34.55,179.6 v34.52,179.57 | v114.4,182.87 R13.2
  Bottom 0.152: v34.52,179.57 32.74,179.57 31.09,177.92 31.09,174.11 32.36,172.84 46.71,172.84 57.51,183.63 112.12,183.63 112.88,182.87 v114.4,182.87
LED9  (via drill 0.35)
  Top 0.152: v116.82,118.73 116.82,179.31 R14.1
  Bottom 0.152: v116.82,118.73 112.37,114.29 112.37,97.78 114.28,97.78 116.82,95.24 117.45,95.24 U$1.J2.9
LED9W  (via drill 0.35)
  Top 0.152: LED9A.A 42.53,176.77 33.38,176.77 33.12,177.03 LED9.A 33,178.01 v33,178.42 | v117.07,182.87 R14.2
  Bottom 0.152: v33,178.42 31.6,177.03 31.6,174.23 32.62,173.22 46.46,173.22 57.51,184.27 114.15,184.27 115.55,182.87 v117.07,182.87
LIGHT_SENSOR  (via drill 0.35)
  Top 0.152: R2.2 27.92,278.75 27.28,279.39 PH1.1 | U$1.J2.5 117.45,105.4 116.18,106.67 116.18,107.94 117.45,109.21 122.53,109.21 122.53,131.43 120.63,133.34 120.63,159.37 125.07,163.82 125.07,168.9 121.26,172.71 121.26,182.87 107.29,196.84 104.62,196.84 102.59,198.87 102.59,200.14 102.34,200.39 71.1,200.39 71.1,207 69.83,208.27 51.67,208.27 49,210.94 47.6,210.94 44.93,213.6 30.58,213.6 v28.04,216.14
  Bottom 0.152: v28.04,216.14 24.61,219.57 24.61,277.94 26.44,279.77 PH1.1
N$1
  Top 0.152: NEO13.2 13.95,69.2 15.85,71.11 15.85,105.4 17.76,107.3 NEO14.4
N$2
  Top 0.152: NEO12.4 53.95,40.63 88.24,40.63 88.24,39.36 89.51,38.09 89.51,37.45 NEO11.2
N$3
  Top 0.152: NEO12.2 48.87,36.82 28.17,36.82 28.17,47.36 24.36,51.17 24.36,65.14 18.39,71.11 18.39,71.74 NEO13.4
N$4
  Top 0.152: NEO14.2 14.15,104.33 16.49,106.67 16.49,108.57 34.01,108.57 34.01,120.26 35.03,121.27 40.62,121.27 40.62,122.54 NEO15.4
N$5  (via drill 0.35)
  Top 0.152: v85.07,121.91 85.07,117.97 38.2,117.97 36.81,119.37 NEO15.2 | v96.5,133.34 97.77,134.61 NEO16.4
  Bottom 0.152: v96.5,133.34 v85.07,121.91
N$6
  Top 0.152: SP1.2 14.23,193.03 R15.2
N$7  (via drill 0.35)
  Top 0.152: v136.37,134.74 R18.1
  Bottom 0.152: v136.37,134.74 136.37,135.12 123.93,147.56 U$3.$GPIO2
N$8
  Top 0.152: NEO4.2 12.58,177.36 13.85,177.36 15.25,175.96 23.52,175.96 26.27,173.22 46.33,173.22 58.78,185.66 58.78,204.84 65.25,204.84 65.89,204.2 67.03,204.2 68.65,205.82 NEO5.4
N$12
  Top 0.152: R1.2 13.6,270.37 11,270.37 NEO1.4
N$13
  Top 0.152: NEO8.2 124.44,137.15 130.79,130.8 130.79,110.48 128.25,107.94 NEO9.4
N$14
  Top 0.152: PIN13.A R3.2
N$15
  Top 0.152: RX.A R4.2
N$16
  Top 0.152: TX.A R5.2
N$18
  Top 0.152: NEO2.4 24.11,240.54 24,240.65 11.03,240.65 2.26,249.42 2.26,265.21 NEO1.2
N$20
  Top 0.152: NEO2.2 20.46,234.64 7.95,222.13 NEO3.4
N$21
  Top 0.152: NEO3.2 1.88,206.79 1.88,180.07 13.69,180.07 13.95,180.33 13.95,180.96 15.85,180.96 NEO4.4
N$23  (via drill 0.35)
  Top 0.152: NEO5.2 62.24,203.39 61.02,202.17 v60.94,202.17 | v103.23,202.17 104.54,202.17 105.1,202.73 NEO6.4
  Bottom 0.152: v103.23,202.17 v60.94,202.17
N$24  (via drill 0.35)
  Top 0.152: v119.1,173.98 118.47,174.61 118.47,185.03 107.09,196.41 104.53,196.41 101.35,199.58 NEO6.2 | v128.25,177.03 128.15,176.93 NEO7.4
  Bottom 0.152: v128.25,177.03 122.15,177.03 v119.1,173.98
N$25
  Top 0.152: NEO8.4 128.25,140.96 130.15,142.86 130.15,165.72 124.44,171.44 124.44,172.07 NEO7.2
N$27
  Top 0.152: NEO10.4 127.61,72.38 126.34,72.38 126.34,101.59 124.44,103.49 124.44,104.13 NEO9.2
N$28
  Top 0.152: NEO11.4 103.83,50.2 104.75,50.55 104.75,53.33 119.99,68.57 123.8,68.57 NEO10.2
NEOPIXEL_OUT  (via drill 0.35)
  Top 0.152: v53.82,204.97 53.82,205.47 48.87,210.43 47.6,210.43 46.08,211.95 10.9,211.95 8.87,213.98 8.87,221.48 18.77,231.38 26.77,231.38 28.3,232.91 28.3,246.88 19.92,255.26 19.92,265.76 R1.1 | U$1.J1.9 132.69,94.6 133.96,95.87 133.96,172.84 132.82,173.98 127.1,173.98 126.21,174.87 126.21,180.46 v125.45,181.22
  Bottom 0.152: v53.82,204.97 56.75,202.05 56.75,186.68 57.25,186.17 120.5,186.17 v125.45,181.22
NEOSTRANDOUT  (via drill 0.35)
  Top 0.152: NEO16.2 94.46,130.4 v94.46,129.91
  Bottom 0.152: v94.46,129.91 101.45,129.91 104.75,133.21 104.75,144.39 111.1,150.74 125.2,150.74 U$3.$GPIO1
PIEZO  (via drill 0.35)
  Top 0.152: R15.1 18.26,182.45 18.26,179.06 4.42,179.06 2.39,177.03 2.39,173.75 3.99,172.15 46.84,172.15 60.99,186.3 105.77,186.3 108.94,183.12 108.94,178.55 112.19,175.3 112.19,170.42 114.91,167.71 v114.91,146.04
  Bottom 0.152: v114.91,146.04 139.42,121.53 139.42,90.79 133.96,90.79 133.33,90.16 132.69,90.16 U$1.J1.11
PIN13_LED  (via drill 0.35)
  Top 0.152: v110.47,125.72 113.64,122.54 113.64,83.17 117.45,79.36 U$1.J2.15 | R3.1 91.1,129.15 99.42,129.15 v101.07,127.5
  Bottom 0.152: v110.47,125.72 102.85,125.72 v101.07,127.5
RST  (via drill 0.35)
  Top 0.152: v120.63,107.3 121.77,106.16 121.77,75.3 102.85,56.38 102.85,56.35 89.64,43.14 RESET.P$2 RESET.P$1
  Bottom 0.152: U$1.J2.3 117.45,109.84 118.09,109.84 v120.63,107.3 130.15,107.3 132.69,109.84 U$1.J1.3
RX_LED  (via drill 0.35)
  Top 0.152: v114.91,130.16 111.1,130.16 106.02,125.08 87.1,125.08 81.32,130.86 80.88,131.31 78.08,134.1 R4.1
  Bottom 0.152: v114.91,130.16 121.9,130.16 122.53,129.53 122.53,120.64 124.44,120.64 132.06,113.02 132.69,113.02 U$1.J1.2
SCL  (via drill 0.35)
  Top 0.152: OLED.3 81.26,127.62 86.34,122.54 109.2,122.54 v109.2,123.18 | U$1.J2.7 117.45,100.32 115.55,102.22 115.55,112.38 117.45,114.29 119.99,114.29 119.99,127.62 U$2.J2.1 119.99,130.16 119.99,160.64 U$2.J1.3
  Bottom 0.152: v109.2,123.18 113.01,126.99 114.28,126.99 114.91,127.62 119.99,127.62 U$2.J2.1 | U$2.J1.3 123.8,157.47 122.4,156.07 122.4,153.53 U$3.$SCL
SDA  (via drill 0.35)
  Top 0.152: OLED.4 52.55,131.31 78.21,131.31 86.34,123.18 108.56,123.18 108.56,125.08 109.2,125.72 | v111.74,128.26 109.2,125.72 | v113.01,102.22 113.01,121.91 109.2,125.72 | U$2.J1.4 121.26,159.37 121.26,133.34 123.17,131.43 123.17,130.16 123.8,129.53 U$2.J2.2
  Bottom 0.152: v111.74,128.26 114.28,130.8 122.53,130.8 123.8,129.53 U$2.J2.2 | v113.01,102.22 117.45,97.78 U$1.J2.8 | U$2.J1.4 126.34,156.58 125.2,155.44 125.2,153.28 U$3.$SDA
TX_LED  (via drill 0.35)
  Top 0.152: R5.1 64.62,134.1 68.81,138.29 v112.24,138.29
  Bottom 0.152: v112.24,138.29 114.78,138.29 121.01,132.07 128.25,132.07 132.69,127.62 U$1.J1.1
VBAT  (via drill 0.35)
  Top 0.508: 31.98,78.98 19.66,78.98 U$6.B+ | v71.73,76.19 40.49,76.19 37.7,78.98 31.98,78.98 | 31.98,78.98 31.98,77.76 R16.1
  Bottom 0.508: v71.73,76.19 99.67,48.25 111.74,48.25 U$4.BAT+
VBAT_SENSE
  Top 0.152: U$1.J2.6 117.45,102.86 119.36,100.95 119.36,75.43 39.85,75.43 38.14,77.14 R17.1 36.61,77.2 R16.2
VBATOUT
  Bottom 0.508: U$6.OUT+ 22.84,98.54 9.25,112.13 9.25,118.99 BATTERY_ON_OFF.P$3
VBOOST_IN
  Top 0.508: BATTERY_ON_OFF.P$2 7.72,122.54 U$7.IN+
VCC  (via drill 0.35)
  Top 0.508: v6.33,274.05 6.33,272.66 NEO1.1 | 19.53,235.45 6.33,222.24 6.33,214.55 NEO3.1 5.95,211.52 5.95,208.27 2.64,204.97 2.64,182.74 4.37,181.01 NEO4.1 | 19.53,235.45 22.2,238.11 NEO2.1 | 19.53,235.45 v18.65,236.34 | OLED.2 45.7,125.08 45.06,124.45 36.81,124.45 36.81,123.18 NEO15.1 36.17,122.54 36.17,121.91 29.19,121.91 C1.2 28.55,121.91 16.49,121.91 16.49,111.11 13.95,108.57 13.95,107.94 NEO14.1 11.96,107.73 10.39,106.16 10.39,101.84 13.95,98.29 13.95,72.38 NEO13.1 | v66.52,204.97 66.48,204.97 NEO5.1 63.81,207.63 v62.33,207.63 | v80.11,204.97 84.81,204.97 C2.2 85.07,205.09 100.94,205.09 100.94,203.19 NEO6.1 101.58,202.55 101.58,201.28 106.66,201.28 124.44,183.5 124.44,175.88 NEO7.1 124.98,174.43 v125.45,174.23 | 94.59,135.24 95.86,136.51 v114.91,136.51 | 94.59,135.24 93.96,134.61 NEO16.1 | NEO12.1 49.51,40.63 51.41,42.53 67.92,42.53 68.56,41.9 90.05,41.9 NEO11.1 90.05,42.44 122.53,74.92 | 122.53,74.92 122.53,105.4 123.8,106.67 123.8,107.3 | 122.53,74.92 122.53,73.65 123.8,72.38 NEO10.1 | 123.8,107.3 122.53,108.57 120.63,108.57 119.36,107.3 117.45,107.3 U$1.J2.4 | 123.8,107.3 NEO9.1 124.44,107.94 124.44,126.99 U$2.J2.3 126.34,129.53 121.9,133.97 121.9,138.42 123.8,140.32 NEO8.1 128.88,145.48 U$2.J1.5 | 94.59,135.24 v93.96,135.88
  Bottom 0.508: PH1.2 22.84,279.39 15.16,279.39 6.36,274.05 v6.33,274.05 6.33,252.34 18.65,240.02 v18.65,236.34 15.85,233.54 15.85,216.9 19.79,212.97 42.52,212.97 44.05,211.44 44.05,211.32 49.25,211.32 52.94,207.63 v62.33,207.63 | v80.11,204.97 v66.52,204.97 | v114.91,136.51 119.99,131.43 123.8,131.43 U$2.J2.3 | v125.45,174.23 128.88,170.8 U$2.J1.5 | OLED.2 62.21,135.88 v93.96,135.88

### Text on the board
bPlace: PIEZO | FOR DESCRIPTION AND ASSEMBLY INSTRUCTIONS: | BUZZER | https://github.com/MakeItHackin/Hatch2020Trophy | THIS TROPHY IS HACKABLE. DO SOMETHING FUN WITH IT!!! | TROPHY DESIGNED BY: ANDREW DENIO @MakeItHackin | REAL TIME CLOCK - DS3231 | SAO v1.69 | 3v3 | 01101110 | 01110010 | 01100101 | 01101100 | 00110100 | 01100100 | 01100101 | 01100110 | 01101001 | R29vZCBqb2IgYXQgZGVjb2RpbmcgdGhpcyBtZXNzYWdlIQ== | DC POWER BOOST MODULE | TROPHY BASE / PRINTED BY: / HUNTSVILLE / STEAMWORKS | 128x32 OLED DISPLAY | OFF ON | BATTERY | ARDUINO NANO v3.0 | CHARGE BATTERY WITH | 5V MICRO-USB CABLE | BATTERY CHARGER | TROPHY AWARDED TO TEAM/PROJECT:
tStop: GTAG | CATC | 01101000 | 01110101 | 01100100 | 01110011 | 01101111 | 01101110 | GTAA | TTAA | 01100001 | 01101100 | 01110000 | 01101000 | 01000011 | 01100001 | TGGG | CGTA | CATT | 01000001 | TACG | ATGC | 01010100 | GATTACACAT | CTAATGTGTA | 01010010 | 01000101 | TAGGATC | 01001011 | ATCCTAG | TTGTACGA | ATGG | TATA | CGCC | 01000011 | GCGG | 01000001 | TAGAC | ATAT | 01001000 | GTAGTA | TATT | 01010011 | 01010100 | GTCC | ATTGGGAA | ACAC | 01000001 | 01010010 | TGTG | CATG | GAAG | TACG | CTTC | TGGA | CACC | CATG | GTAC | GTAC | ATTAC | TAAT | ACCA | GATTGACT | ATTA | CGCC | TGTCAGGCTA | GTGG | GTCC | CACC | 01010111 | 01000001 | 01010010 | 01010011 | FOR AN EXTRA CHALLENGE, DECODE THIS TROPHY :)
bStop: GATTACACAT | CATCATCAT | FOR AN EXTRA CHALLENGE, DECODE THIS TROPHY :)